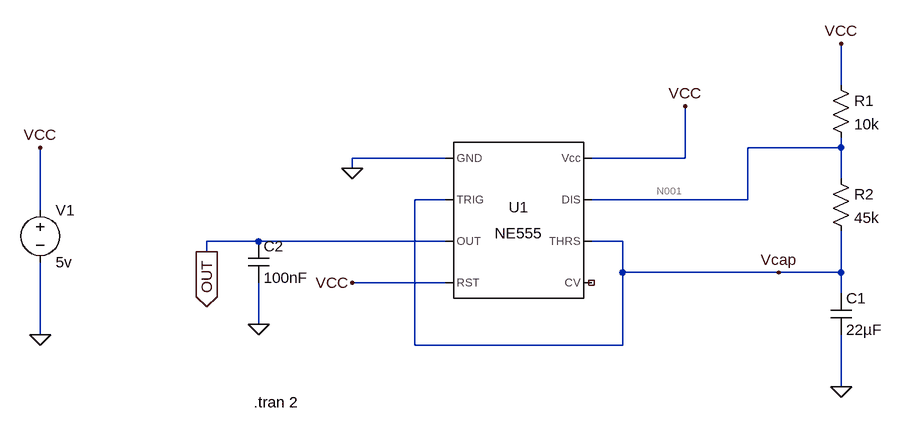
[diagram p0: schematic schematic.asc]
schematic.asc, the LTspice schematic file:
Version 4
SHEET 1 880 680
WIRE 672 -32 672 -96
WIRE 672 64 672 48
WIRE 672 64 528 64
WIRE 64 80 -80 80
WIRE 432 80 432 0
WIRE 432 80 288 80
WIRE -80 96 -80 80
WIRE 672 112 672 64
WIRE 64 144 16 144
WIRE 528 144 528 64
WIRE 528 144 288 144
WIRE -560 160 -560 64
WIRE -224 208 -304 208
WIRE 64 208 -224 208
WIRE 336 208 288 208
WIRE -304 224 -304 208
WIRE 336 256 336 208
WIRE 576 256 336 256
WIRE 672 256 672 192
WIRE 672 256 576 256
WIRE 64 272 -80 272
WIRE 672 288 672 256
WIRE -224 336 -224 272
WIRE -560 352 -560 240
WIRE 16 368 16 144
WIRE 336 368 336 256
WIRE 336 368 16 368
WIRE 672 432 672 352
FLAG 432 0 VCC
FLAG -80 272 VCC
FLAG -80 96 0
FLAG -304 224 OUT
IOPIN -304 224 Out
FLAG 672 432 0
FLAG 672 -96 VCC
FLAG -560 352 0
FLAG -560 64 VCC
FLAG 576 256 Vcap
FLAG -224 336 0
SYMBOL Misc\\NE555 176 176 R0
SYMATTR InstName U1
SYMBOL res 656 -48 R0
SYMATTR InstName R1
SYMATTR Value 10k
SYMBOL res 656 96 R0
SYMATTR InstName R2
SYMATTR Value 45k
SYMBOL cap 656 288 R0
SYMATTR InstName C1
SYMATTR Value 22µF
SYMBOL voltage -560 144 R0
WINDOW 123 0 0 Left 0
WINDOW 39 0 0 Left 0
SYMATTR InstName V1
SYMATTR Value 5v
SYMBOL cap -240 208 R0
SYMATTR InstName C2
SYMATTR Value 100nF
TEXT -232 456 Left 2 !.tran 2

The netlist it stands for:
* schematic.asc
XU1 0 Vcap OUT VCC NC_01 Vcap N001 VCC NE555  ; pins GND TRIG OUT RST CV THRS DIS Vcc
R1 VCC N001 10k
R2 N001 Vcap 45k
C1 Vcap 0 22µF
V1 VCC 0 5v
C2 OUT 0 100nF
.tran 2
.lib NE555.sub
.backanno
.end

* Results of the author's LTspice run, read from the files saved beside the schematic
* Operating Point, zero values left out:
*   V(vcap) = 4.999 V
*   V(vcc) = 5 V
*   V(n001) = 5 V
*   V(out) = 5 V
*   I(R2) = 9.999 nA
*   I(R1) = 16.67 nA
*   I(V1) = -1.611 mA
*   Ix(u1:1) = -1.611 mA
*   Ix(u1:2) = 4.999 nA
*   Ix(u1:4) = 22.67 µA
*   Ix(u1:6) = 4.999 nA
*   Ix(u1:7) = 6.671 nA
*   Ix(u1:8) = 1.588 mA
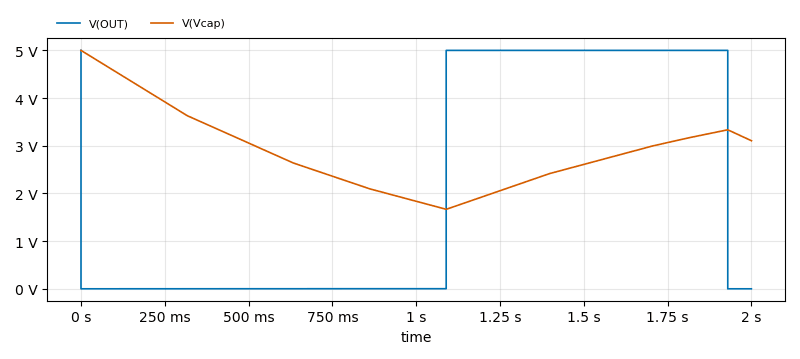
[diagram p1: Transient Analysis of schematic.asc, plotted from the saved traces]
* Transient Analysis, 1 run:
*   V(OUT): min 30 µV, max 5 V, average 2.1 V, rms 3.24 V, last 30 µV
*   V(Vcap): min 1.666 V, max 4.999 V, average 2.864 V, rms 2.995 V, last 3.105 V